# Altium schematic sheet Hardwiring.SchDoc
size 594 x 420 mm; Address1: Address1; Address2: Address2; Address3: Address3; Address4: Address4; DocumentNumber: *Э3; SheetNumber: 11; SheetTotal: 11; DocumentType: Схема электрическая *
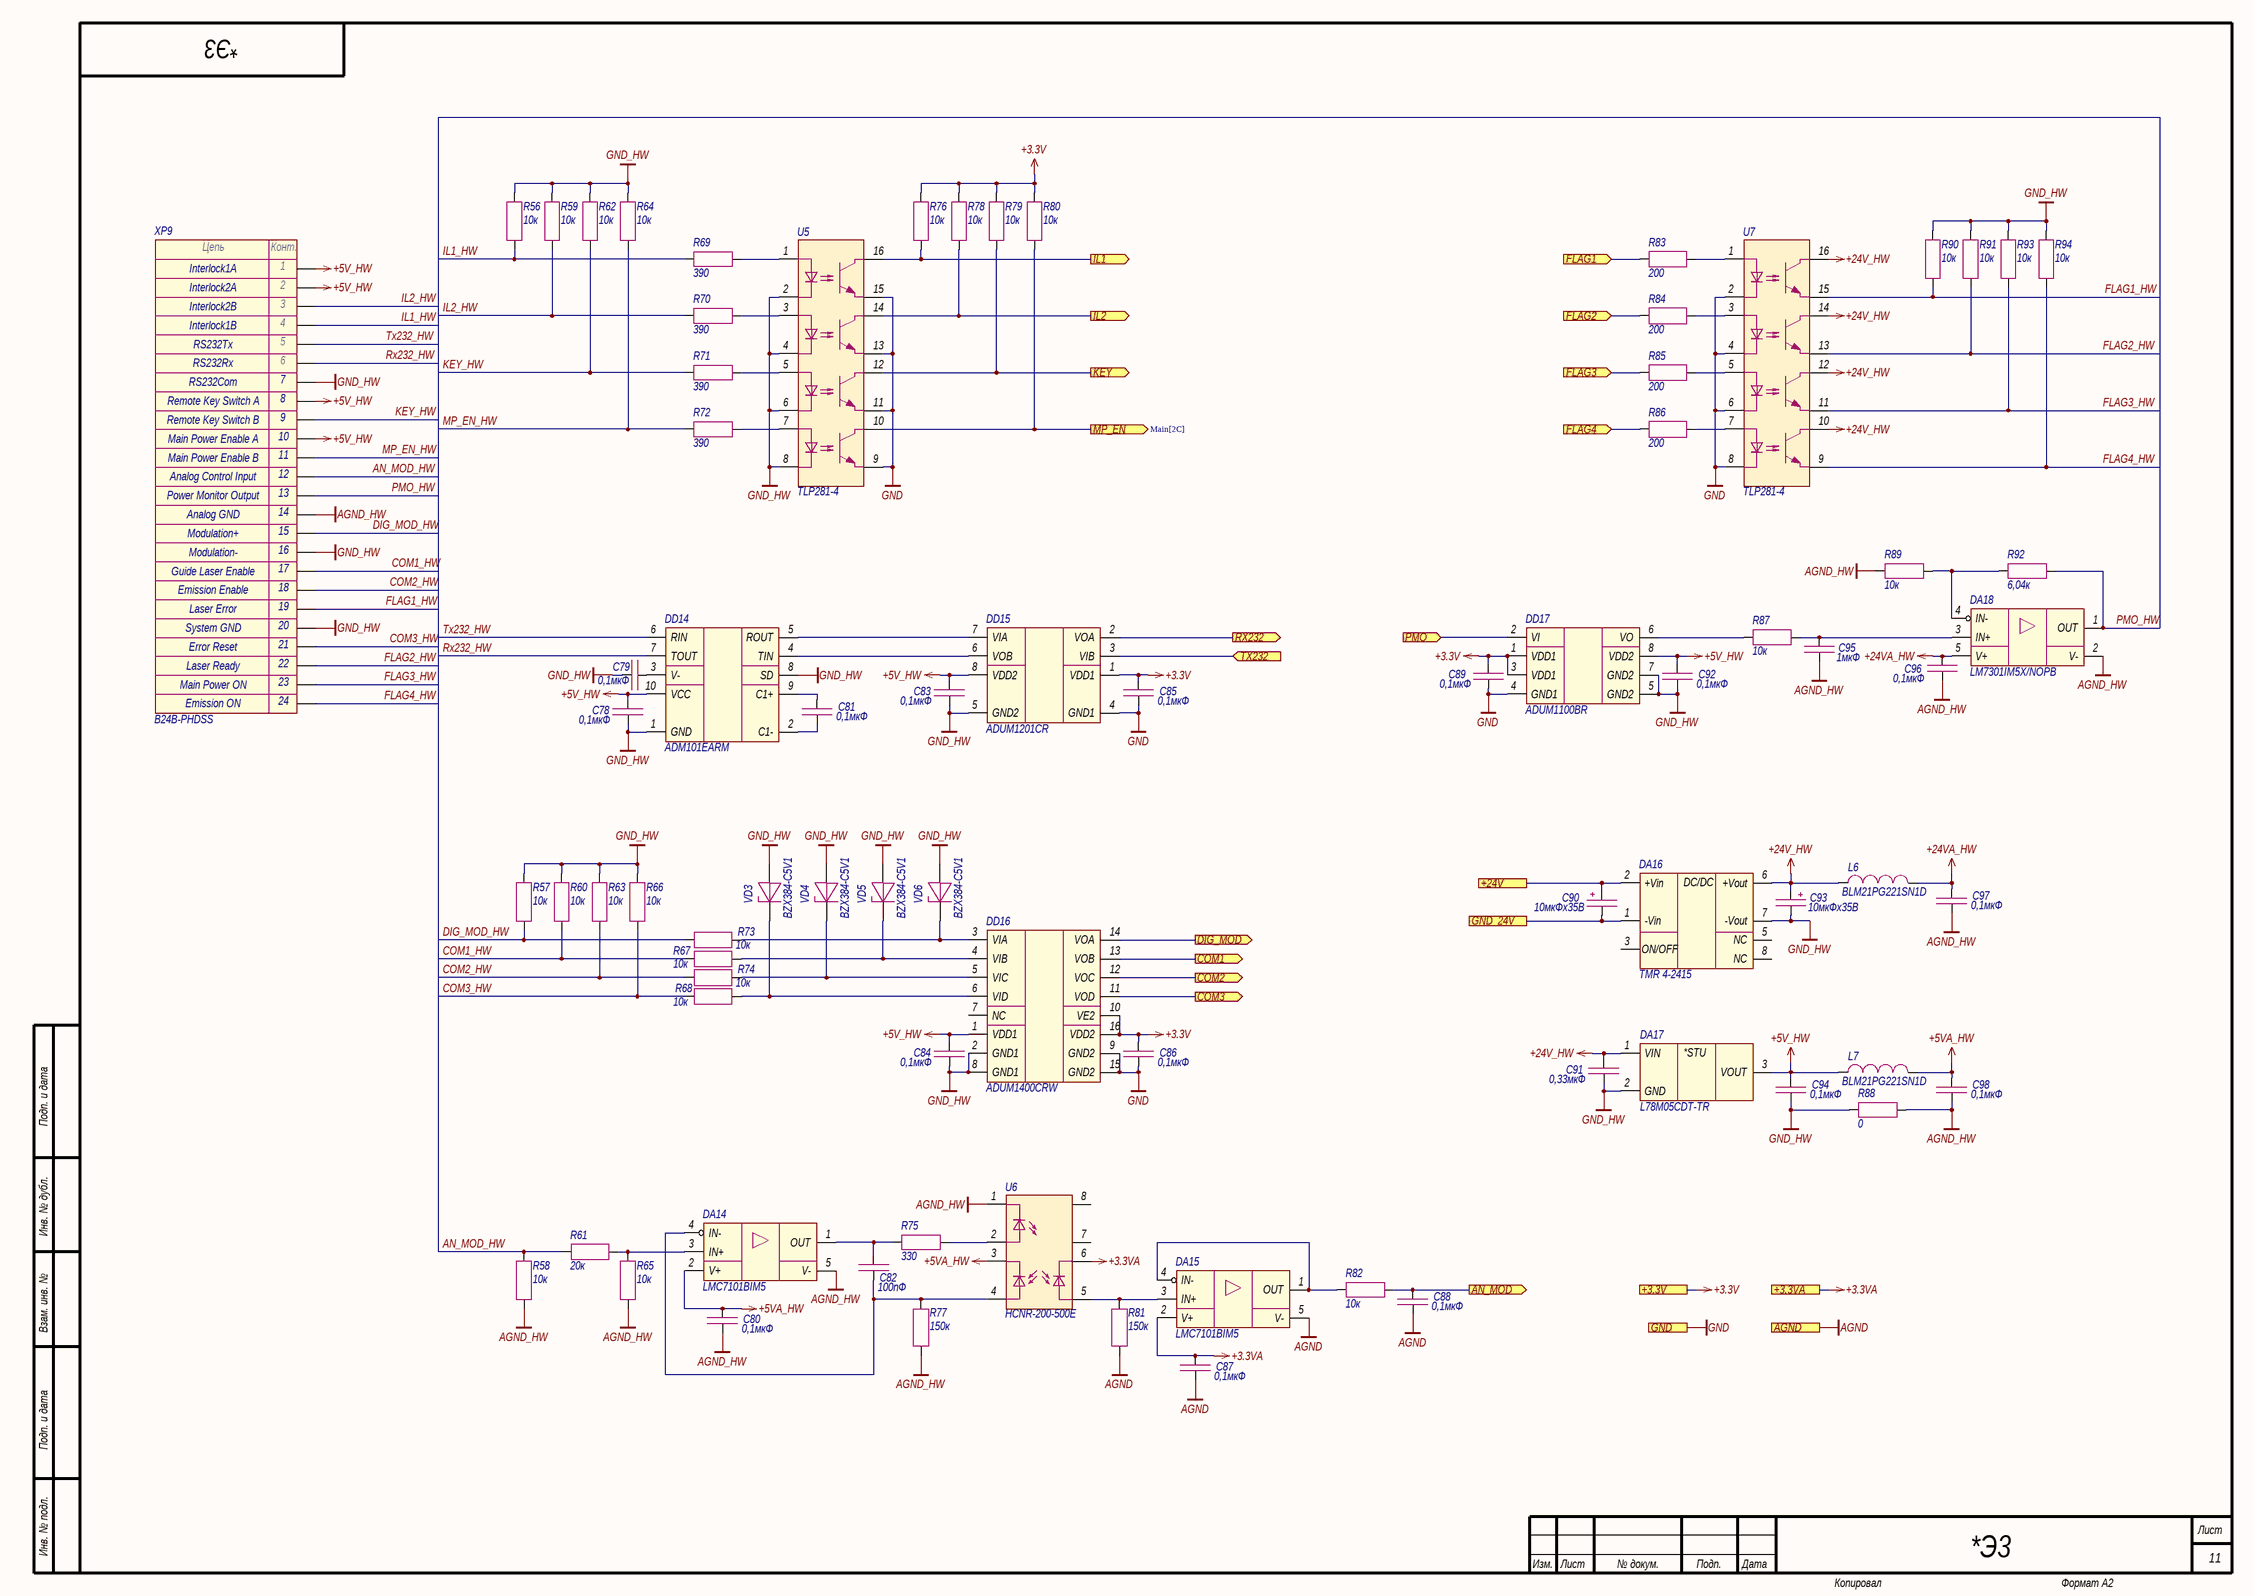
[diagram p0: Hardwiring.SchDoc]

## Parts
C78  0,1мкФ  [CAP_0603]
C79  0,1мкФ  [CAP_0603]
C80  0,1мкФ  [CAP_0603]
C81  0,1мкФ  [CAP_0603]
C82  100пФ  [CAP_0603]
C83  0,1мкФ  [CAP_0603]
C84  0,1мкФ  [CAP_0603]
C85  0,1мкФ  [CAP_0603]
C86  0,1мкФ  [CAP_0603]
C87  0,1мкФ  [CAP_0603]
C88  0,1мкФ  [CAP_0603]
C89  0,1мкФ  [CAP_0603]
C90  10мкФх35B  [CAP_C]
C91  0,33мкФ  [CAP_0805]
C92  0,1мкФ  [CAP_0603]
C93  10мкФх35B  [CAP_C]
C94  0,1мкФ  [CAP_0603]
C95  1мкФ  [CAP_0603]
C96  0,1мкФ  [CAP_0603]
C97  0,1мкФ  [CAP_0603]
C98  0,1мкФ  [CAP_0603]
DA14  LMC7101BIM5  [SOT-23-5]
DA15  LMC7101BIM5  [SOT-23-5]
DA16  TMR 4-2415  [TMR4 (SIP-8)]
DA17  L78M05CDT-TR  [TO-252]
DA18  LM7301IM5X/NOPB  [SOT-23-5]
DD14  ADM101EARM  [MSOP-10]
DD15  ADUM1201CR  [SOIC-8]
DD16  ADUM1400CRW  [SOIC-16W]
DD17  ADUM1100BR  [SOIC-8]
L6  BLM21PG221SN1D  [IND_0805]
L7  BLM21PG221SN1D  [IND_0805]
R56  10к  [RES_0603]
R57  10к  [RES_0603]
R58  10к  [RES_0603]
R59  10к  [RES_0603]
R60  10к  [RES_0603]
R61  20к  [RES_0603]
R62  10к  [RES_0603]
R63  10к  [RES_0603]
R64  10к  [RES_0603]
R65  10к  [RES_0603]
R66  10к  [RES_0603]
R67  10к  [RES_0603]
R68  10к  [RES_0603]
R69  390  [RES_0603]
R70  390  [RES_0603]
R71  390  [RES_0603]
R72  390  [RES_0603]
R73  10к  [RES_0603]
R74  10к  [RES_0603]
R75  330  [RES_0603]
R76  10к  [RES_0603]
R77  150к  [RES_0603]
R78  10к  [RES_0603]
R79  10к  [RES_0603]
R80  10к  [RES_0603]
R81  150к  [RES_0603]
R82  10к  [RES_0603]
R83  200  [RES_0603]
R84  200  [RES_0603]
R85  200  [RES_0603]
R86  200  [RES_0603]
R87  10к  [RES_0603]
R88  0  [RES_0805]
R89  10к  [RES_0603]
R90  10к  [RES_0603]
R91  10к  [RES_0603]
R92  6,04к  [RES_0603]
R93  10к  [RES_0603]
R94  10к  [RES_0603]
U5  TLP281-4  [SOP-16]
U6  HCNR-200-500E  [HCNR200]
U7  TLP281-4  [SOP-16]
VD3  BZX384-C5V1  [SOD-323]
VD4  BZX384-C5V1  [SOD-323]
VD5  BZX384-C5V1  [SOD-323]
VD6  BZX384-C5V1  [SOD-323]
XP9  B24B-PHDSS  [B24B-PHDSS]

## Ports
+3.3V (see Main[2C], Ethernet[3D], Fiber_interlock[2C], LD_driver[1D], Power_supply[2D], Protection[2C]), +3.3VA (see Main[2C], LD_driver[2D], Thermistor[2C]), +24V (see Main[2C], Indication[1C], LD_driver[1D], Power_supply[2C]), AGND (see Main[2C], LD_driver[2D], Photodiode[1C], Thermistor[2C]), AN_MOD (out, see Main[2C]), COM1 (out, see Main[2C]), COM2 (out, see Main[2C]), COM3 (out, see Main[2C]), DIG_MOD (out, see Main[2C]), FLAG1 (in, see Main[2B]), FLAG2 (in, see Main[2B]), FLAG3 (in, see Main[2C]), FLAG4 (in, see Main[2C]), GND (see Main[2C], Ethernet[3D], Fiber_interlock[2C], Guide_laser[1C], Indication[1C], LD_driver[1D], Power_supply[2D], Protection[2C]), GND_24V (see Main[2C], Indication[1C], LD_driver[1D], Power_supply[2C]), IL1 (out, see Main[2B]), IL2 (out, see Main[2B]), KEY (out, see Main[2C]), MP_EN (out, see Main[2C]), PMO (in, see Main[2C]), RX232 (out, see Main[2C]), TX232 (in, see Main[2C])

## Nets
+3.3V: C85.1 C86.1 C89.1 DD15.1(VDD1) DD16.10(VE2) DD16.16(VDD2) DD17.1(VDD1) DD17.3(VDD1) R76.1 R78.1 R79.1 R80.1 ; port +3.3V
+3.3VA: C87.1 DA15.2(V+) U6.6 ; port +3.3VA
+5V_HW: C78.1 C83.1 C84.1 C92.1 C94.1 DA17.3(VOUT) DD14.10(VCC) DD15.8(VDD2) DD16.1(VDD1) DD17.8(VDD2) L7.1 XP9.1 XP9.2 XP9.8 XP9.10
+5VA_HW: C80.1 C98.1 DA14.2(V+) L7.2 U6.3
+24V_HW: C91.2 C93.1 DA16.6(+Vout) DA17.1(VIN) L6.1 U7.10 U7.12 U7.14 U7.16
+24VA_HW: C96.1 C97.1 DA18.5(V+) L6.2
AGND: C87.2 C88.2 DA15.5(V-) R81.2 ; port AGND
AGND_HW: C80.2 C95.2 C96.2 C97.2 C98.2 DA14.5(V-) DA18.2(V-) R58.2 R65.2 R77.2 R88.2 R89.1 U6.1 XP9.14
GND: C85.2 C86.2 C89.2 DD15.4(GND1) DD16.9(GND2) DD16.15(GND2) DD17.4(GND1) U5.9 U5.11 U5.13 U5.15 U7.2 U7.4 U7.6 U7.8 ; port GND
GND_HW: C78.2 C79.2 C83.2 C84.2 C91.1 C92.2 C93.2 C94.2 DA16.7(-Vout) DA17.2(GND) DD14.1(GND) DD14.8(SD) DD15.5(GND2) DD16.2(GND1) DD16.8(GND1) DD17.5(GND2) DD17.7(GND2) R56.1 R57.1 R59.1 R60.1 R62.1 R63.1 R64.1 R66.1 R88.1 R90.1 R91.1 R93.1 R94.1 U5.2 U5.4 U5.6 U5.8 VD3.2(A) VD4.2(A) VD5.2(A) VD6.2(A) XP9.7 XP9.16 XP9.20
+24V: C90.1 DA16.2(+Vin) ; port +24V
AN_MOD: C88.1 R82.2 ; port AN_MOD
AN_MOD_HW: R58.1 R61.1 XP9.12
COM1: DD16.13(VOB) ; port COM1
COM1_HW: R60.2 R67.1 XP9.17
COM2: DD16.12(VOC) ; port COM2
COM2_HW: R63.2 R74.1 XP9.18
COM3: DD16.11(VOD) ; port COM3
COM3_HW: R66.2 R68.1 XP9.21
DIG_MOD: DD16.14(VOA) ; port DIG_MOD
DIG_MOD_HW: R57.2 R73.1 XP9.15
FLAG1: R83.2 ; port FLAG1
FLAG1_HW: R90.2 U7.15 XP9.19
FLAG2: R84.2 ; port FLAG2
FLAG2_HW: R91.2 U7.13 XP9.22
FLAG3: R85.2 ; port FLAG3
FLAG3_HW: R93.2 U7.11 XP9.23
FLAG4: R86.2 ; port FLAG4
FLAG4_HW: R94.2 U7.9 XP9.24
GND_24V: C90.2 DA16.1(-Vin) ; port GND_24V
IL1: R76.2 U5.16 ; port IL1
IL1_HW: R56.2 R69.1 XP9.4
IL2: R78.2 U5.14 ; port IL2
IL2_HW: R59.2 R70.1 XP9.3
KEY: R79.2 U5.12 ; port KEY
KEY_HW: R62.2 R71.1 XP9.9
MP_EN: R80.2 U5.10 ; port MP_EN
MP_EN_HW: R64.2 R72.1 XP9.11
PMO: DD17.2(VI) ; port PMO
PMO_HW: DA18.1(OUT) R92.2 XP9.13
RX232: DD15.2(VOA) ; port RX232
Rx232_HW: DD14.7(TOUT) XP9.6
TX232: DD15.3(VIB) ; port TX232
Tx232_HW: DD14.6(RIN) XP9.5
NetC79_1: C79.1 DD14.3(V-)
NetC81_1: C81.1 DD14.9(C1+)
NetC81_2: C81.2 DD14.2(C1-)
NetC82_1: C82.1 DA14.1(OUT) R75.1
NetC82_2: C82.2 DA14.4(IN-) R77.1 U6.4
NetC95_1: C95.1 DA18.3(IN+) R87.2
NetDA14_3: DA14.3(IN+) R61.2 R65.1
NetDA15_1: DA15.1(OUT) DA15.4(IN-) R82.1
NetDA15_3: DA15.3(IN+) R81.1 U6.5
NetDA18_4: DA18.4(IN-) R89.2 R92.1
NetDD14_4: DD14.4(TIN) DD15.6(VOB)
NetDD14_5: DD14.5(ROUT) DD15.7(VIA)
NetDD16_3: DD16.3(VIA) R73.2 VD6.1(K)
NetDD16_4: DD16.4(VIB) R67.2 VD5.1(K)
NetDD16_5: DD16.5(VIC) R74.2 VD4.1(K)
NetDD16_6: DD16.6(VID) R68.2 VD3.1(K)
NetDD17_6: DD17.6(VO) R87.1
NetR69_2: R69.2 U5.1
NetR70_2: R70.2 U5.3
NetR71_2: R71.2 U5.5
NetR72_2: R72.2 U5.7
NetR75_2: R75.2 U6.2
NetR83_1: R83.1 U7.1
NetR84_1: R84.1 U7.3
NetR85_1: R85.1 U7.5
NetR86_1: R86.1 U7.7

Not connected (* = marked no-connect by the designer): DA16 3(ON/OFF) 5(NC) 8(NC); DD16 7(NC); U6 7 8

## Notes on the sheet
- Interlock1A
- Interlock2A
- Interlock2B
- Interlock1B
- RS232Tx
- RS232Rx
- RS232Com
- (near XP9) Remote Key Switch A
- (near XP9) Remote Key Switch B
- (near XP9) Main Power Enable A
- (near XP9) Main Power Enable B
- (near XP9) Analog Control Input
- (near XP9) Power Monitor Output
- Analog GND
- Modulation+
- Modulation-
- (near XP9) Guide Laser Enable
- (near XP9) Emission Enable
- System GND
- Error Reset
- Laser Error
- Main Power ON
- Emission ON
- Laser Ready
- Подп. и дата
- Инв. № дубл.
- Взам. инв. №
- Инв. № подл.
- Изм.
- Лист
- № докум.
- Подп.
- Дата
- Копировал
- Формат А2
- (in symbol Connector-24) Цепь; Конт.
- (in symbol L78M) *STU
- (in symbol TMR4) DC/DC

## Library data of the parts
C78-C81 C83-C89 C92 C94 C96-C98 = Capacitor: Manufacturer: Murata; Model: GRM188R71H104KA93D; Value: 0,1мкФ; Document: *
C82 = Capacitor: Manufacturer: Murata; Model: GRM1885C1H101JA01D; Value: 100пФ; Document: *
C90 C93 = Capacitor_Polar: Model: TECAP, 10 мкФ, 35 В, тип C, 10%; Value: 10мкФх35B; Document: *; Manufacturer: *
C91 = Capacitor: Manufacturer: Murata; Model: GRM219R71H334KA88D; Value: 0,33мкФ; Document: *
C95 = Capacitor: Manufacturer: Murata; Model: GRM188R61H105KAALD; Value: 1мкФ; Document: *
DA14 DA15 = LMC7101: Manufacturer: Texas Instruments; Model: LMC7101BIM5; Document: *
DA16 = TMR4: Manufacturer: Traco Power; Model: TMR 4-2415; Document: *
DA17 = L78M: Manufacturer: STMicroelectronics; Model: L78M05CDT-TR; Document: *
DA18 = LM7301IM5: Manufacturer: Texas Instruments; Model: LM7301IM5X/NOPB; Document: *
DD14 = ADM101EARM: Manufacturer: Analog Devices; Model: ADM101EARM; Document: *
DD15 = ADUM1201: Manufacturer: Analog Devices; Model: ADUM1201CR; Document: *
DD16 = ADUM1400: Manufacturer: Analog Devices; Model: ADUM1400CRW; Document: *
DD17 = ADUM1100: Manufacturer: Analog Devices; Model: ADUM1100BR; Document: *
L6 L7 = Inductor: Manufacturer: Murata; Value: *; Model: BLM21PG221SN1D; Document: *
R56-R60 R62-R68 R73 R74 R76 R78-R80 R82 R87 R89-R91 R93 R94 = Resistor: Manufacturer: Yageo; Model: RC0603FR-0710KL; Value: 10к; Document: *
R61 = Resistor: Manufacturer: Yageo; Model: RC0603FR-0720KL; Value: 20к; Document: *
R69-R72 = Resistor: Manufacturer: Yageo; Model: RC0603FR-07390RL; Value: 390; Document: *
R75 = Resistor: Manufacturer: Yageo; Model: RC0603FR-07330RL; Value: 330; Document: *
R77 R81 = Resistor: Manufacturer: Yageo; Model: RC0603FR-07150KL; Value: 150к; Document: *
R83-R86 = Resistor: Manufacturer: Yageo; Model: RC0603FR-07200RL; Value: 200; Document: *
R88 = Resistor: Manufacturer: Yageo; Model: RC0805FR-070RL; Value: 0; Document: *
R92 = Resistor: Manufacturer: Yageo; Model: RC0603FR-076K04L; Value: 6,04к; Document: *
U5 U7 = TLP281-4: Manufacturer: Toshiba; Model: TLP281-4; Document: *
U6 = HCNR200: Manufacturer: Avago; Model: HCNR-200-500E; Document: *
VD3-VD6 = Diode_Zener: Manufacturer: Nexperia; Model: BZX384-C5V1; Document: *
XP9 = Connector-24: Manufacturer: JST; Model: B24B-PHDSS; Document: *